# EasyEDA schematic pr.json
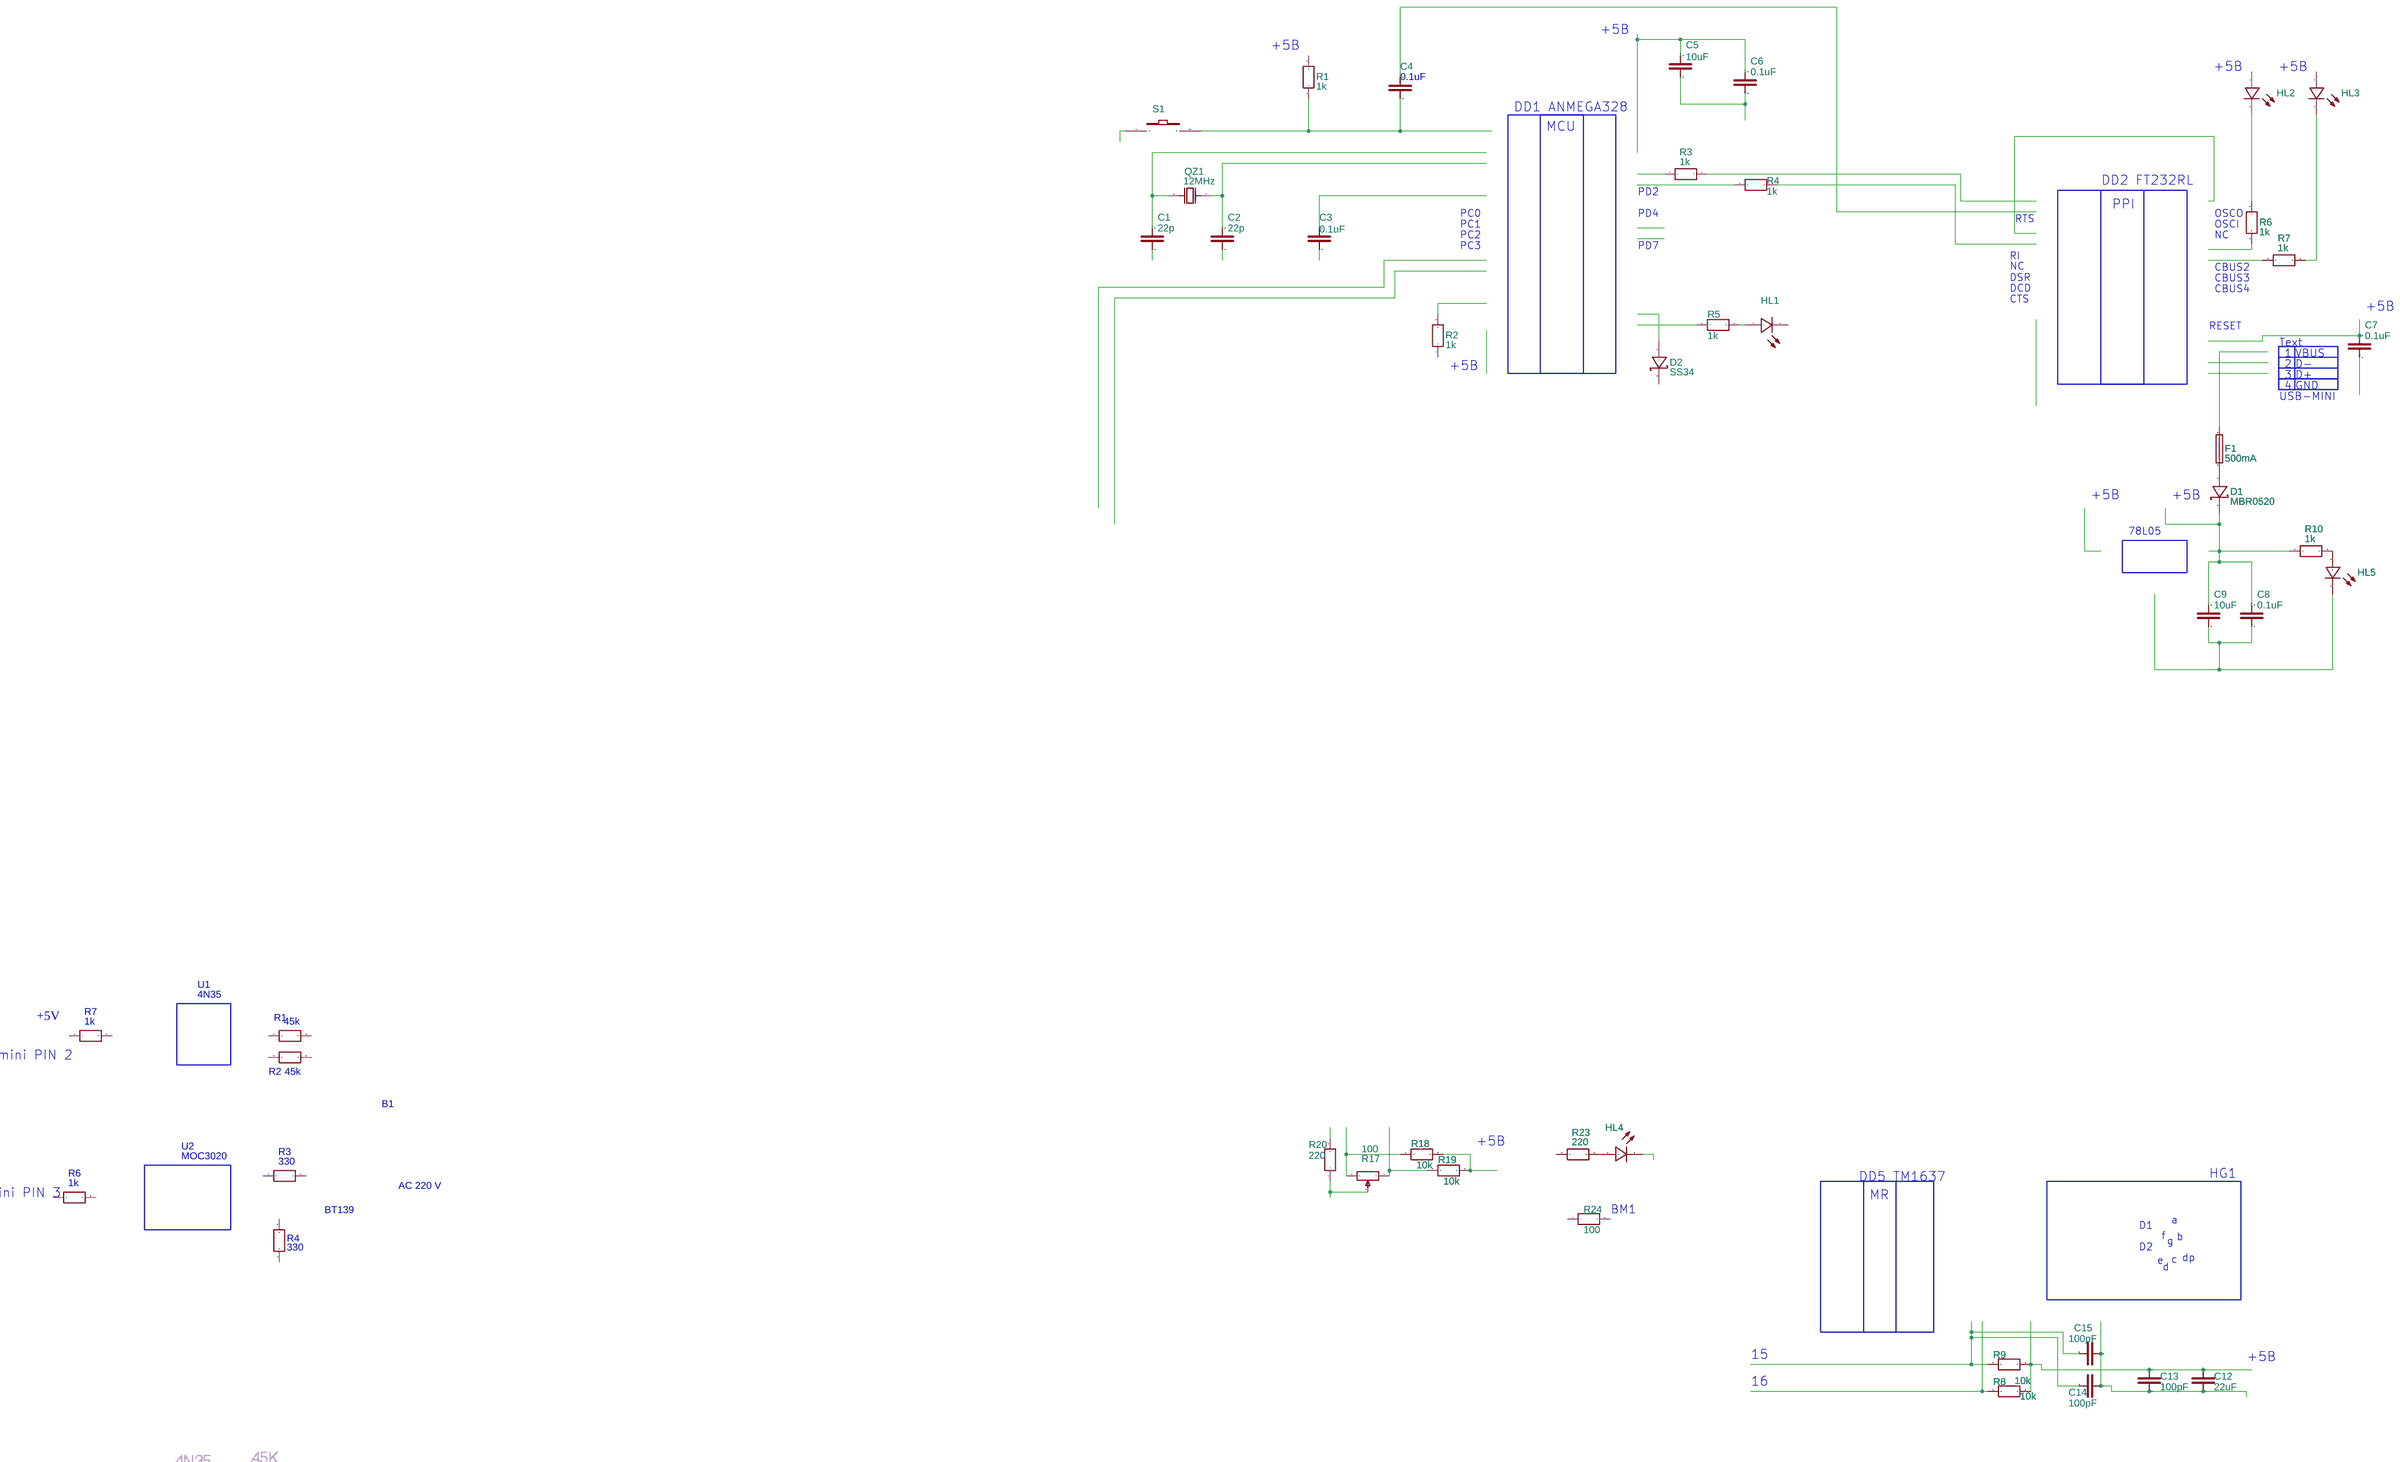
[diagram p0: schematic sheet]

## Parts
C1  22p  [TWO_IO]
C2  22p  [TWO_IO]
C3  0.1uF  [TWO_IO]
C4  Condensator1  [TWO_IO]
C5  10uF  [TWO_IO]
C6  0.1uF  [TWO_IO]
C7  0.1uF  [TWO_IO]
C8  0.1uF  [TWO_IO]
C9  10uF  [TWO_IO]
C12  22uF  [TWO_IO]
C13  100pF  [TWO_IO]
C14  100pF  [TWO_IO]
C15  100pF  [TWO_IO]
D1  MBR0520  [SMA(DO-214AC)]
D2  SS34  [SMA(DO-214AC)]
F1  500mA  [2A-3F-250VAC]
HL1  LED-3MM  [LED-3MM/2.54]
HL2  LED-3MM  [LED-3MM/2.54]
HL3  LED-3MM  [LED-3MM/2.54]
HL4  LED-3MM  [LED-3MM/2.54]
HL5  LED-3MM  [LED-3MM/2.54]
QZ1  12MHz  [OSC-49S-1]
R1  1k  [AXIAL-0.3]
R2  1k  [AXIAL-0.3]
R3  1k  [AXIAL-0.3]
R4  1k  [AXIAL-0.3]
R5  1k  [AXIAL-0.3]
R6  1k  [AXIAL-0.3]
R7  1k  [AXIAL-0.3]
R8  10k  [AXIAL-0.3]
R9  10k  [AXIAL-0.3]
R10  1k  [AXIAL-0.3]
R12  1k  [AXIAL-0.3]
R13  1k  [AXIAL-0.3]
R14  1k  [AXIAL-0.3]
R15  1k  [AXIAL-0.3]
R16  1k  [AXIAL-0.3]
R17  100  [RES-ADJ_3386P]
R18  10k  [AXIAL-0.3]
R19  10k  [AXIAL-0.3]
R20  220  [AXIAL-0.3]
R21  1k  [AXIAL-0.3]
R23  220  [AXIAL-0.3]
R24  100  [AXIAL-0.3]
S1  EVQ22705R  [KEY-6.0*6.0-4]

## Library data of the parts
C1-C9 C12-C15 = -: Contributor: paulheystee; Manufacturer Part: ?
D1 = -: Supplier: LCSC; Manufacturer Part: SS34; Manufacturer: MDD; image: //image.lceda.cn/szlcsc/C8678.jpg; Supplier Part: C8678; LCSC Assembly: Yes; SMT Type: Extend
D2 = -: Supplier: LCSC; Manufacturer: MDD; image: //image.lceda.cn/szlcsc/C8678.jpg; Supplier Part: C8678; LCSC Assembly: Yes; SMT Type: Extend
F1 = -: Supplier: LCSC; Manufacturer Part: Glass tube fuse2A 3F 250VAC; Manufacturer: XCFuse; image: //image.lceda.cn/szlcsc/C71017.jpg; Supplier Part: C71017
HL1-HL5 = -: Supplier: LCSC; Manufacturer: EVERLIGHT; Manufacturer Part: 204-10SURD/S530-A3; Supplier Part: C99772
QZ1 = X49SD12MSD2SC: Supplier: LCSC; Manufacturer: YXC; Supplier Part: C16369
R1-R9 R18-R20 R23 R24 = Res_AXIAL-0.3(1/8W)_EU: Manufacturer Part: ?
R10 R12-R16 R21 = Res_AXIAL-0.3(1/8W)_EU
R17 = 3386P-1-101LF: Supplier: LCSC; Manufacturer: Bochen; Supplier Part: C125022
S1 = -: Supplier: LCSC; Manufacturer: PANASONIC; Contributor: LCSC; Supplier Part: C79156

## Nets
Net-(C1-P$2): C1.P$2 QZ1.2(OSC2)
Net-(C2-P$2): C2.P$2 QZ1.1(OSC1)
Net-(C4-P$1): C4.P$1 R1.1 S1.2
Net-(C5-P$1): C5.P$1 C6.P$1
Net-(C5-P$2): C5.P$2 C6.P$2
Net-(C8-P$1): C8.P$1 C9.P$1 HL5.2(-)
Net-(C8-P$2): C8.P$2 C9.P$2 D1.2(K) R10.1
Net-(C12-P$1): C12.P$1 C13.P$2 C14.P$1 C15.P$1
Net-(C12-P$2): C12.P$2 C13.P$1 R8.2 R9.2
Net-(C14-P$2): C14.P$2 C15.P$2 R9.1
Net-(D1-1): D1.1(A) F1.1
Net-(HL1-1): HL1.1(+) R5.2
Net-(HL2-2): HL2.2(-) R6.1
Net-(HL3-2): HL3.2(-) R7.2
Net-(HL4-1): HL4.1(+) R23.2
Net-(HL5-1): HL5.1(+) R10.2
Net-(R17-1): R17.1 R19.1
Net-(R17-2): R17.2 R20.1
Net-(R17-3): R17.3 R18.1
Net-(R18-2): R18.2 R19.2

Not connected (* = marked no-connect by the designer): C1 P$1; C2 P$1; C3 P$1 P$2; C4 P$2; C7 P$1 P$2; D2 1(A) 2(K); F1 2; HL1 2(-); HL2 1(+); HL3 1(+); HL4 2(-); R1 2; R2 1 2; R3 1 2; R4 1 2; R5 1; R6 2; R7 1; R8 1; R12 1 2; R13 1 2; R14 1 2; R15 1 2; R16 1 2; R20 2; R21 1 2; R23 1; R24 1 2; S1 1

## Notes on the sheet
- +5B
- +5B
- +5B
- +5B
- 0.1uF
- DD1 ANMEGA328
- MCU
- DD2 FT232RL
- PD2
- PPI
- PC0
- PD4
- OSCO
- PC1
- RTS
- OSCI
- PC2
- NC
- PC3
- PD7
- RI
- NC
- CBUS2
- DSR
- CBUS3
- DCD
- CBUS4
- CTS
- +5B
- RESET
- Text
- 1
- VBUS
- +5B
- 2
- D-
- 3
- D+
- USB-MINI
- 4
- GND
- +5B
- +5B
- 78L05
- U1
- 4N35
- +5V
- R7
- 1k
- R1
- 45k
- Arduino Pro mini PIN 2
- R2
- 45k
- B1
- +5B
- MOC3020
- U2
- R3
- 330
- HG1
- R6
- DD5 TM1637
- Arduino Pro mini PIN 3
- 1k
- AC 220 V
- MR
- BM1
- BT139
- a
- D1
- f
- R4
- D2
- g
- b
- 330
- e
- c
- dp
- d
- 15
- +5B
- 16
